# Altium schematic sheet PA_Channel.SchDoc
size A4
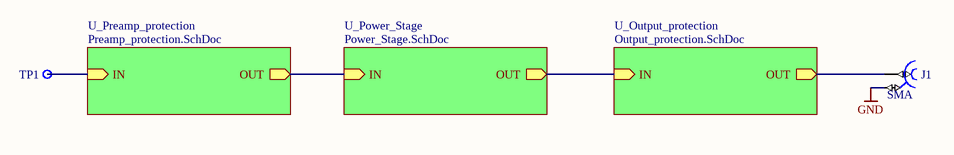
[diagram p0: PA_Channel.SchDoc]

## Parts
J1  SMA  [MOLEX_73251-2121]
TP1  Test Point  [TPS127]  (value not drawn)

## Sub-sheets
U_Output_protection = Output_protection.SchDoc: IN (in), OUT (out)
U_Power_Stage = Power_Stage.SchDoc: IN (in), OUT (out)
U_Preamp_protection = Preamp_protection.SchDoc: OUT (out), IN (in)

## Nets
GND: J1.2
NetJ1_1: J1.1 ; sheet U_Output_protection/OUT
NetTP1_1: TP1.1 ; sheet U_Preamp_protection/IN
(unnamed): sheet U_Output_protection/IN, sheet U_Power_Stage/OUT
(unnamed): sheet U_Power_Stage/IN, sheet U_Preamp_protection/OUT

## Library data of the parts
J1 = MOLEX_73251-2121: Part Description: 50 Ohm, SMA Edge Mount PCB, With Jam Nut And Lock Washer; Manufacturer: MOLEX; PressFit: No; Part Number: MOLEX_73251-2121; Component Kind: Standard; Component Type: Standard; Pin Count: 5; Family: SMA; Mounted: Yes; Socket: No; SMD: Yes; Sense: No; Status: None; Manufacturer Part Number: 73251-2121; ComponentHeight: 5.75mm; HelpURL: \\cern.ch\dfs\Applications\Altium\Datasheets\MOLEX_73251-2121.pdf; Author: CERN DEM JLC; CreateDate: 26.10.2016; LatestRevisionDate: 26.10.2016
TP1 = SMD_PAD_1.27X1.27MM: Part Description: 1.27mm x 1.27mm PCB Copper Area (SMD Test Point); Mounted: No; Part Number: SMD_PAD_1.27X1.27MM; Component Kind: Standard (No BOM); Component Type: Standard (No BOM); Pin Count: 1; Family: Test Point; Socket: No; SMD: Yes; Sense: No; Status: None; ComponentHeight: 0mm; HelpURL: Undefined; Author: CERN DEM JLC; CreateDate: 12.01.2008; LatestRevisionDate: 12.01.2008; PackageDescription: 1.27mm x 1.27mm PCB Copper Area (SMD Test Point)